# Altium schematic sheet MCU.SchDoc
size A3; Revision: C.2(PCB.SCH)
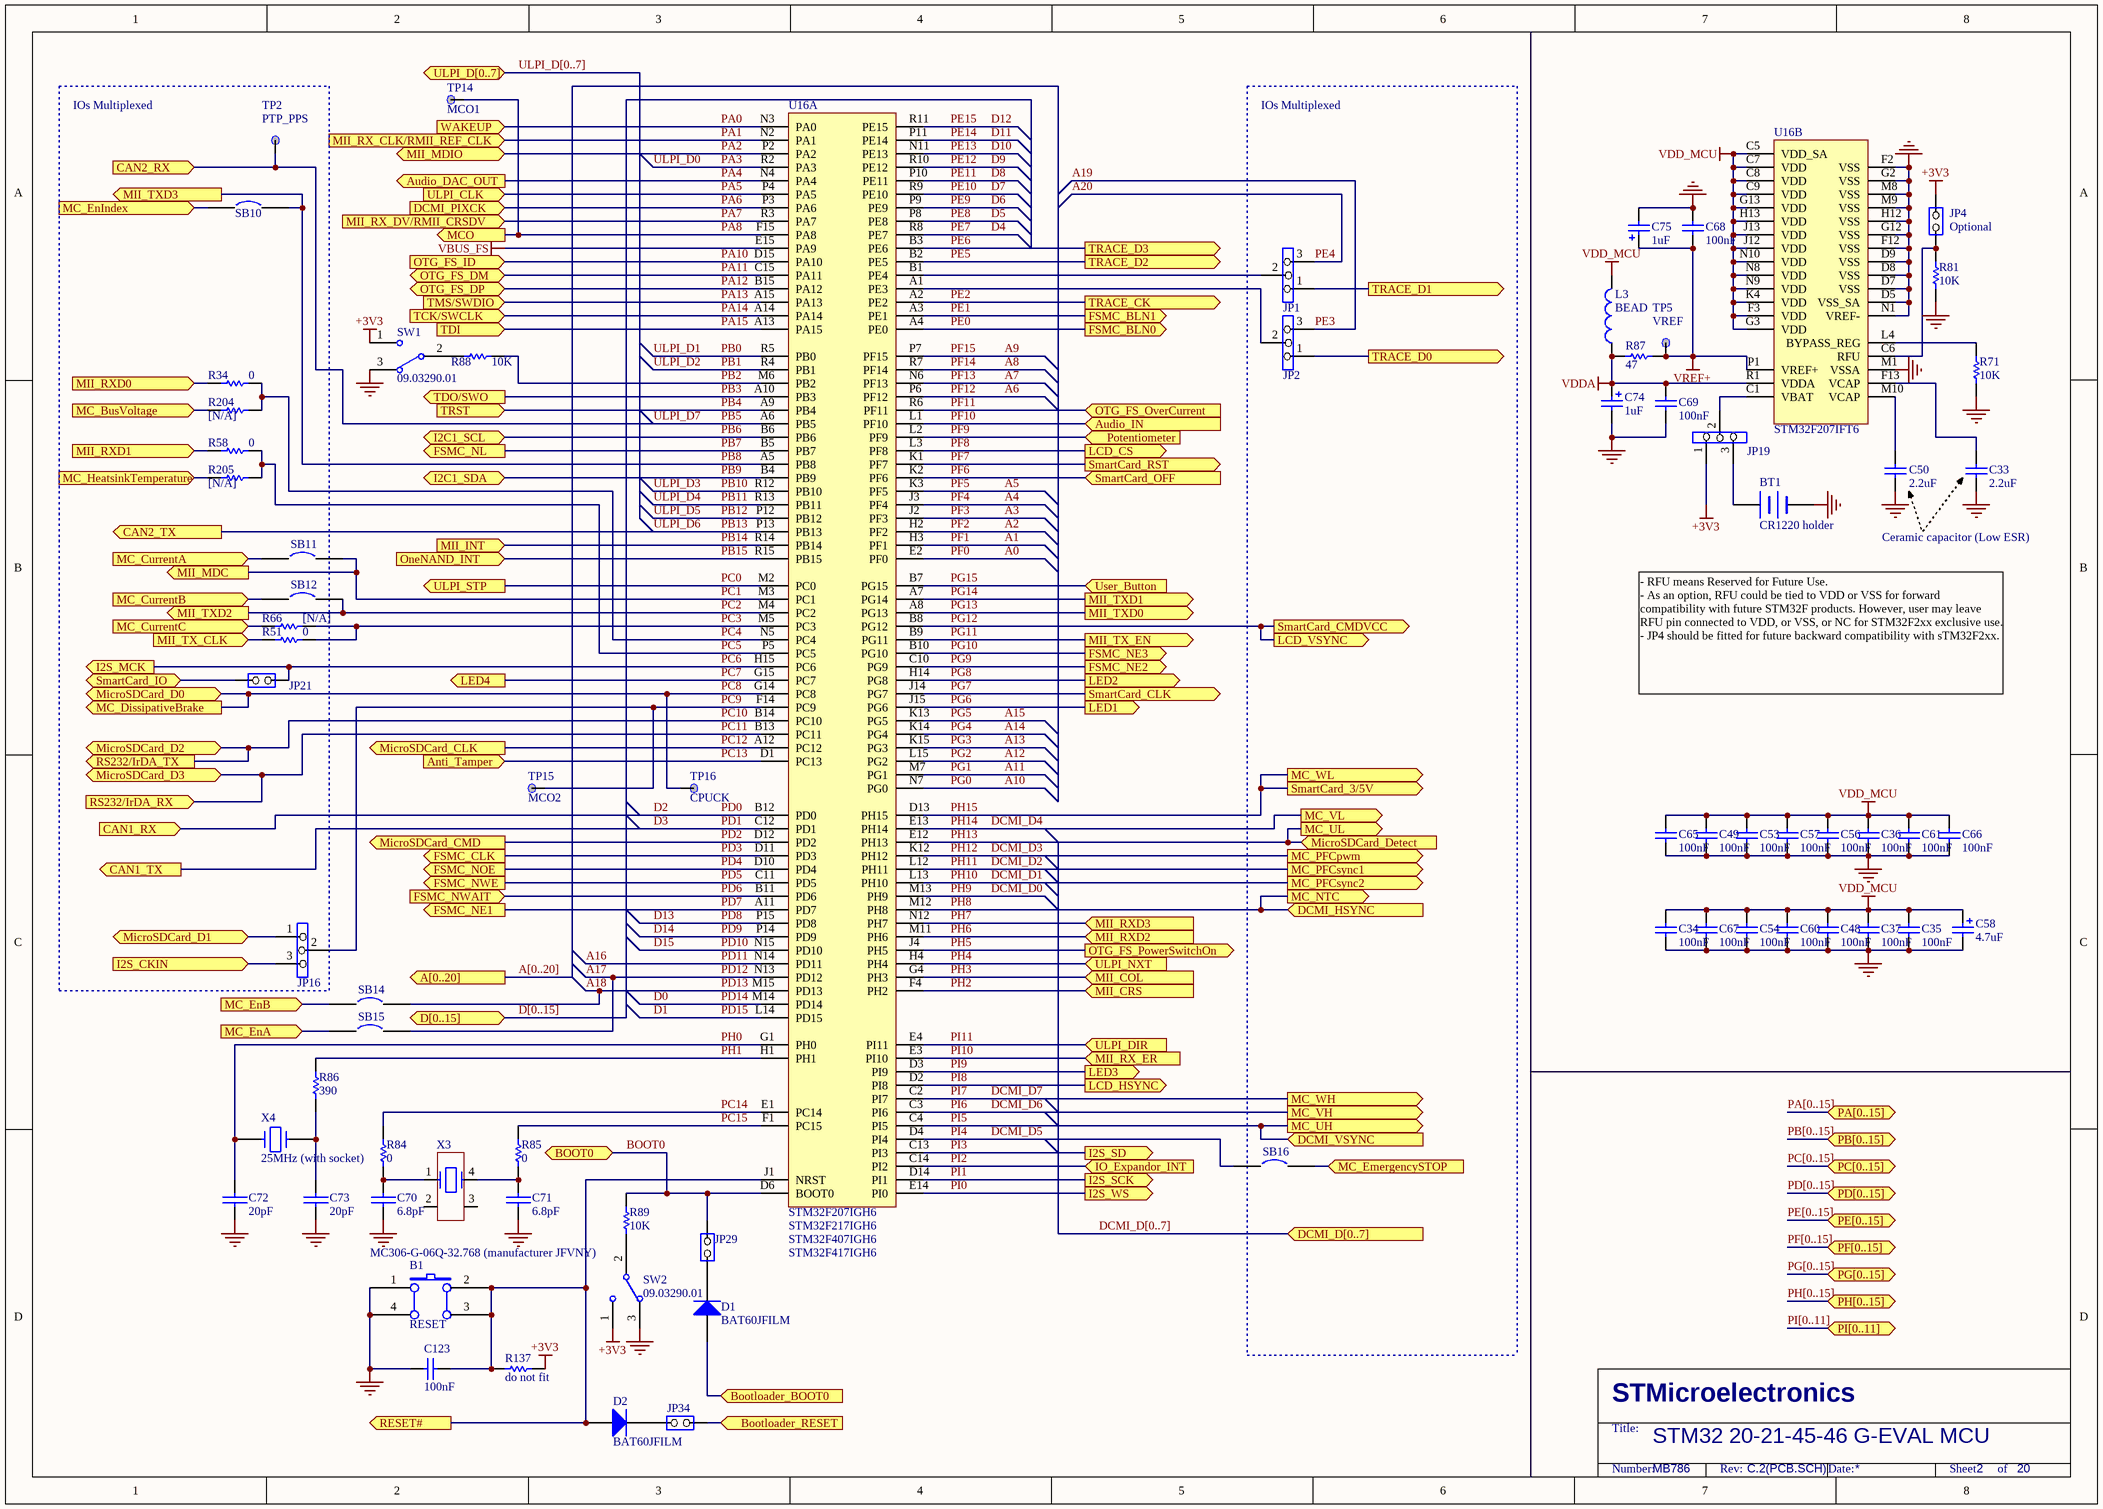
[diagram p0: MCU.SchDoc]

## Parts
B1  RESET  [PB10]
BT1  CR1220 holder  [LI1220_1]
C33  2.2uF  [1206C]
C34  100nF  [0402C]
C35  100nF  [0402C]
C36  100nF  [0402C]
C37  100nF  [0402C]
C48  100nF  [0402C]
C49  100nF  [0402C]
C50  2.2uF  [1206C]
C53  100nF  [0402C]
C54  100nF  [0402C]
C56  100nF  [0402C]
C57  100nF  [0402C]
C58  4.7uF  [TAN-A]
C60  100nF  [0402C]
C61  100nF  [0402C]
C65  100nF  [0402C]
C66  100nF  [0402C]
C67  100nF  [0402C]
C68  100nF  [0402C]
C69  100nF  [0402C]
C70  6.8pF  [0603C]
C71  6.8pF  [0603C]
C72  20pF  [0603C]
C73  20pF  [0603C]
C74  1uF  [TAN-A]
C75  1uF  [TAN-A]
C123  100nF  [0402C]
D1  BAT60JFILM  [SOD-323]
D2  BAT60JFILM  [SOD-323]
JP1  (no value)  [SIP3]
JP2  (no value)  [SIP3]
JP4  (no value)  [SIP2]
JP16  (no value)  [SIP3]
JP19  (no value)  [SIP3]
JP21  (no value)  [SIP2]
JP29  (no value)  [SIP2]
JP34  (no value)  [SIP2]
L3  BEAD  [0603L]
R34  0  [0603R]
R51  0  [0603R]
R58  0  [0603R]
R66  [N/A]  [0603R]
R71  10K  [0402R]
R81  10K  [0402R]
R84  0  [0603R]
R85  0  [0603R]
R86  390  [0603R]
R87  47  [0603R]
R88  10K  [0402R]
R89  10K  [0402R]
R137  do not fit  [0603R]
R204  [N/A]  [0603R]
R205  [N/A]  [0603R]
SB10  (no value)  [JP2_SMD]
SB11  (no value)  [JP2_SMD]
SB12  (no value)  [JP2_SMD]
SB14  (no value)  [JP2_SMD]
SB15  (no value)  [JP2_SMD]
SB16  (no value)  [JP2_SMD]
SW1  09.03290.01  [SIP3]
SW2  09.03290.01  [SIP3]
TP2  PTP_PPS  [TP]
TP5  VREF  [TP]
TP14  MCO1  [TP]
TP15  MCO2  [TP]
TP16  CPUCK  [TP]
U16  STM32F207IGH6  [UFBGA176]  (parts A,B of 2)
X3  MC306-G-06Q-32.768 (manufacturer JFVNY)  [SM8]
X4  25MHz (with socket)  [XTAL_socket]

## Blocks framed on the sheet
IOs Multiplexed: JP1 JP2 SB16

## Ports
A[0..20] (out), Anti_Tamper (in), Audio_DAC_OUT (out), Audio_IN (in), BOOT0 (bidir), Bootloader_BOOT0 (in), Bootloader_RESET (in), CAN1_RX (in), CAN1_TX (out), CAN2_RX (in), CAN2_TX (out), D[0..15] (bidir), DCMI_D[0..7] (in), DCMI_HSYNC (in), DCMI_PIXCK (in), DCMI_VSYNC (in), FSMC_BLN0 (out), FSMC_BLN1 (out), FSMC_CLK (out), FSMC_NE1 (out), FSMC_NE2 (out), FSMC_NE3 (out), FSMC_NL (out), FSMC_NOE (out), FSMC_NWAIT (in), FSMC_NWE (out), I2C1_SCL (bidir), I2C1_SDA (bidir), I2S_CKIN (in), I2S_MCK (out), I2S_SCK (out), I2S_SD (out), I2S_WS (out), IO_Expandor_INT (in), LCD_CS (out), LCD_HSYNC (out), LCD_VSYNC (out), LED1 (out), LED2 (out), LED3 (out), LED4 (out), MC_BusVoltage (in), MC_CurrentA (in), MC_CurrentB (in), MC_CurrentC (in), MC_DissipativeBrake (out), MC_EmergencySTOP (in), MC_EnA (in), MC_EnB (in), MC_EnIndex (in), MC_HeatsinkTemperature (in), MC_NTC (out), MC_PFCpwm (out), MC_PFCsync1 (out), MC_PFCsync2 (out), MC_UH (out), MC_UL (out), MC_VH (out), MC_VL (out), MC_WH (out), MC_WL (out), MCO (out), MicroSDCard_CLK (out), MicroSDCard_CMD (out), MicroSDCard_D0 (bidir), MicroSDCard_D1 (bidir), MicroSDCard_D2 (bidir), MicroSDCard_D3 (bidir), MicroSDCard_Detect (in), MII_COL (in), MII_CRS (in), MII_INT (in), MII_MDC (out), MII_MDIO (bidir), MII_RX_CLK/RMII_REF_CLK (in), MII_RX_DV/RMII_CRSDV (in), MII_RX_ER (in), MII_RXD0 (in), MII_RXD1 (in), MII_RXD2 (in), MII_RXD3 (in), MII_TX_CLK (in), MII_TX_EN (out), MII_TXD0 (out), MII_TXD1 (out), MII_TXD2 (out), MII_TXD3 (out), OneNAND_INT (in), OTG_FS_DM (bidir), OTG_FS_DP (bidir), OTG_FS_ID (in), OTG_FS_OverCurrent (in), OTG_FS_PowerSwitchOn (out), PA[0..15] (bidir), PB[0..15] (bidir), PC[0..15] (bidir), PD[0..15] (bidir), PE[0..15] (bidir), PF[0..15] (bidir), PG[0..15] (bidir), PH[0..15] (bidir), PI[0..11] (bidir), Potentiometer (in), RESET# (out), RS232/IrDA_RX (in), RS232/IrDA_TX (out), SmartCard_3/5V (out), SmartCard_CLK (out), SmartCard_CMDVCC (out), SmartCard_IO (bidir), SmartCard_OFF (in), SmartCard_RST (out), TCK/SWCLK (in), TDI (in), TDO/SWO (out), TMS/SWDIO (in), TRACE_CK (out), TRACE_D0 (out), TRACE_D1 (out), TRACE_D2 (out), TRACE_D3 (out), TRST (in), ULPI_CLK (in), ULPI_D[0..7] (bidir), ULPI_DIR (in), ULPI_NXT (in), ULPI_STP (out), User_Button (in), WAKEUP (in)

## Nets
+3V3: JP4.1(COMMON) JP19.1 R137.2 SW1.1 SW2.1
GND: B1.1(A0) B1.4(A1) BT1.2(-) C33.2 C34.2 C35.2 C36.2 C37.2 C48.2 C49.2 C50.2 C53.2 C54.2 C56.2 C57.2 C58.2 C60.2 C61.2 C65.2 C66.2 C67.2 C68.2 C69.2 C70.2 C71.2 C72.2 C73.2 C74.2 C75.2 C123.1 R71.2 R81.2 SW1.3 SW2.3 U16.D5(VSS_SA) U16.D7(VSS) U16.D8(VSS) U16.D9(VSS) U16.F2(VSS) U16.F12(VSS) U16.G2(VSS) U16.G12(VSS) U16.H12(VSS) U16.M1(VSSA) U16.M8(VSS) U16.M9(VSS) U16.N1(VREF-)
VBUS_FS: U16.E15(PA9)
VDD_MCU: C34.1 C35.1 C36.1 C37.1 C48.1 C49.1 C53.1 C54.1 C56.1 C57.1 C58.1 C60.1 C61.1 C65.1 C66.1 C67.1 L3.2 U16.C5(VDD_SA) U16.C7(VDD) U16.C8(VDD) U16.C9(VDD) U16.F3(VDD) U16.G3(VDD) U16.G13(VDD) U16.H13(VDD) U16.J12(VDD) U16.J13(VDD) U16.K4(VDD) U16.N8(VDD) U16.N9(VDD) U16.N10(VDD)
VDDA: C69.1 C74.1 L3.1 R87.2 U16.R1(VDDA)
VREF+: C68.1 C75.1 R87.1 TP5.1 U16.P1(VREF+)
A0: U16.E2(PF0)  [also labelled PF0]
A1: U16.H3(PF1)  [also labelled PF1]
A2: U16.H2(PF2)  [also labelled PF2]
A3: U16.J2(PF3)  [also labelled PF3]
A4: U16.J3(PF4)  [also labelled PF4]
A5: U16.K3(PF5)  [also labelled PF5]
A6: U16.P6(PF12)  [also labelled PF12]
A7: U16.N6(PF13)  [also labelled PF13]
A8: U16.R7(PF14)  [also labelled PF14]
A9: U16.P7(PF15)  [also labelled PF15]
A10: U16.N7(PG0)  [also labelled PG0]
A11: U16.M7(PG1)  [also labelled PG1]
A12: U16.L15(PG2)  [also labelled PG2]
A13: U16.K15(PG3)  [also labelled PG3]
A14: U16.K14(PG4)  [also labelled PG4]
A15: U16.K13(PG5)  [also labelled PG5]
A16: U16.N14(PD11)  [also labelled PD11]
A17: SB15.2 U16.N13(PD12)  [also labelled PD12]
A18: SB14.2 U16.M15(PD13)  [also labelled PD13]
A19: JP2.3  [also labelled PE3]
A20: JP1.3  [also labelled PE4]
BOOT0: JP29.1(COMMON) R89.1 U16.D6(BOOT0) ; port BOOT0
Bootloader_BOOT0: D1.1(A) ; port Bootloader_BOOT0
Bootloader_RESET: JP34.2(NO) ; port Bootloader_RESET
D0: U16.M14(PD14)  [also labelled PD14]
D1: U16.L14(PD15)  [also labelled PD15]
D2: U16.B12(PD0) ; port CAN1_RX  [also labelled PD0]
D3: U16.C12(PD1) ; port CAN1_TX  [also labelled PD1]
D4: U16.R8(PE7)  [also labelled PE7]
D5: U16.P8(PE8)  [also labelled PE8]
D6: U16.P9(PE9)  [also labelled PE9]
D7: U16.R9(PE10)  [also labelled PE10]
D8: U16.P10(PE11)  [also labelled PE11]
D9: U16.R10(PE12)  [also labelled PE12]
D10: U16.N11(PE13)  [also labelled PE13]
D11: U16.P11(PE14)  [also labelled PE14]
D12: U16.R11(PE15)  [also labelled PE15]
D13: U16.P15(PD8)  [also labelled PD8]
D14: U16.P14(PD9)  [also labelled PD9]
D15: U16.N15(PD10)  [also labelled PD10]
DCMI_D0: U16.M13(PH9)  [also labelled PH9]
DCMI_D1: U16.L13(PH10) ; port MC_PFCsync2  [also labelled PH10]
DCMI_D2: U16.L12(PH11) ; port MC_PFCsync1  [also labelled PH11]
DCMI_D3: U16.K12(PH12) ; port MC_PFCpwm  [also labelled PH12]
DCMI_D4: U16.E13(PH14) ; port MC_VL  [also labelled PH14]
DCMI_D5: SB16.1 U16.D4(PI4)  [also labelled PI4]
DCMI_D6: U16.C3(PI6) ; port MC_VH  [also labelled PI6]
DCMI_D7: U16.C2(PI7) ; port MC_WH  [also labelled PI7]
I2S_CKIN: JP16.3 ; port I2S_CKIN
MC_BusVoltage: R204.1 ; port MC_BusVoltage
MC_CurrentA: SB11.1 ; port MC_CurrentA
MC_CurrentB: SB12.1 ; port MC_CurrentB
MC_CurrentC: R66.1 ; port MC_CurrentC
MC_EmergencySTOP: SB16.2 ; port MC_EmergencySTOP
MC_EnA: SB15.1 ; port MC_EnA
MC_EnB: SB14.1 ; port MC_EnB
MC_EnIndex: SB10.1 ; port MC_EnIndex
MC_HeatsinkTemperature: R205.1 ; port MC_HeatsinkTemperature
MicroSDCard_D1: JP16.1 ; port MicroSDCard_D1
MII_RXD0: R34.1 ; port MII_RXD0
MII_RXD1: R58.1 ; port MII_RXD1
MII_TX_CLK: R51.1 ; port MII_TX_CLK
PA0: U16.N3(PA0) ; port WAKEUP
PA1: U16.N2(PA1) ; port MII_RX_CLK/RMII_REF_CLK
PA2: U16.P2(PA2) ; port MII_MDIO
PA3: U16.R2(PA3)  [also labelled ULPI_D0]
PA4: U16.N4(PA4) ; port Audio_DAC_OUT
PA5: U16.P4(PA5) ; port ULPI_CLK
PA6: U16.P3(PA6) ; port DCMI_PIXCK
PA7: U16.R3(PA7) ; port MII_RX_DV/RMII_CRSDV
PA8: TP14.1 U16.F15(PA8) ; port MCO
PA10: U16.D15(PA10) ; port OTG_FS_ID
PA11: U16.C15(PA11) ; port OTG_FS_DM
PA12: U16.B15(PA12) ; port OTG_FS_DP
PA13: U16.A15(PA13) ; port TMS/SWDIO
PA14: U16.A14(PA14) ; port TCK/SWCLK
PA15: U16.A13(PA15) ; port TDI
PB0: U16.R5(PB0)  [also labelled ULPI_D1]
PB1: U16.R4(PB1)  [also labelled ULPI_D2]
PB2: R88.1 U16.M6(PB2)
PB3: U16.A10(PB3) ; port TDO/SWO
PB4: U16.A9(PB4) ; port TRST
PB5: TP2.1 U16.A6(PB5) ; port CAN2_RX  [also labelled ULPI_D7]
PB6: U16.B6(PB6) ; port I2C1_SCL
PB7: U16.B5(PB7) ; port FSMC_NL
PB8: SB10.2 U16.A5(PB8) ; port MII_TXD3
PB9: U16.B4(PB9) ; port I2C1_SDA
PB10: U16.R12(PB10)  [also labelled ULPI_D3]
PB11: U16.R13(PB11)  [also labelled ULPI_D4]
PB12: U16.P12(PB12)  [also labelled ULPI_D5]
PB13: U16.P13(PB13) ; port CAN2_TX  [also labelled ULPI_D6]
PB14: U16.R14(PB14) ; port MII_INT
PB15: U16.R15(PB15) ; port OneNAND_INT
PC0: U16.M2(PC0) ; port ULPI_STP
PC1: SB11.2 U16.M3(PC1) ; port MII_MDC
PC2: SB12.2 U16.M4(PC2) ; port MII_TXD2
PC3: R51.2 R66.2 U16.M5(PC3)
PC4: R34.2 R204.2 U16.N5(PC4)
PC5: R58.2 R205.2 U16.P5(PC5)
PC6: JP21.1(COMMON) U16.H15(PC6) ; port I2S_MCK
PC7: U16.G15(PC7) ; port LED4
PC8: TP16.1 U16.G14(PC8) ; port MicroSDCard_D0, port MC_DissipativeBrake
PC9: JP16.2 TP15.1 U16.F14(PC9)
PC10: U16.B14(PC10) ; port RS232/IrDA_TX, port MicroSDCard_D2
PC11: U16.B13(PC11) ; port RS232/IrDA_RX, port MicroSDCard_D3
PC12: U16.A12(PC12) ; port MicroSDCard_CLK
PC13: U16.D1(PC13) ; port Anti_Tamper
PC14: R84.2 U16.E1(PC14)
PC15: R85.2 U16.F1(PC15)
PD2: U16.D12(PD2) ; port MicroSDCard_CMD
PD3: U16.D11(PD3) ; port FSMC_CLK
PD4: U16.D10(PD4) ; port FSMC_NOE
PD5: U16.C11(PD5) ; port FSMC_NWE
PD6: U16.B11(PD6) ; port FSMC_NWAIT
PD7: U16.A11(PD7) ; port FSMC_NE1
PE0: U16.A4(PE0) ; port FSMC_BLN0
PE1: U16.A3(PE1) ; port FSMC_BLN1
PE2: U16.A2(PE2) ; port TRACE_CK
PE5: U16.B2(PE5) ; port TRACE_D2
PE6: U16.B3(PE6) ; port TRACE_D3
PF6: U16.K2(PF6) ; port SmartCard_OFF
PF7: U16.K1(PF7) ; port SmartCard_RST
PF8: U16.L3(PF8) ; port LCD_CS
PF9: U16.L2(PF9) ; port Potentiometer
PF10: U16.L1(PF10) ; port Audio_IN
PF11: U16.R6(PF11) ; port OTG_FS_OverCurrent
PG6: U16.J15(PG6) ; port LED1
PG7: U16.J14(PG7) ; port SmartCard_CLK
PG8: U16.H14(PG8) ; port LED2
PG9: U16.C10(PG9) ; port FSMC_NE2
PG10: U16.B10(PG10) ; port FSMC_NE3
PG11: U16.B9(PG11) ; port MII_TX_EN
PG12: U16.B8(PG12) ; port SmartCard_CMDVCC, port LCD_VSYNC
PG13: U16.A8(PG13) ; port MII_TXD0
PG14: U16.A7(PG14) ; port MII_TXD1
PG15: U16.B7(PG15) ; port User_Button
PH0: C72.1 U16.G1(PH0) X4.2
PH1: R86.1 U16.H1(PH1)
PH2: U16.F4(PH2) ; port MII_CRS
PH3: U16.G4(PH3) ; port MII_COL
PH4: U16.H4(PH4) ; port ULPI_NXT
PH5: U16.J4(PH5) ; port OTG_FS_PowerSwitchOn
PH6: U16.M11(PH6) ; port MII_RXD2
PH7: U16.N12(PH7) ; port MII_RXD3
PH8: U16.M12(PH8) ; port DCMI_HSYNC, port MC_NTC
PH13: U16.E12(PH13) ; port MicroSDCard_Detect, port MC_UL
PH15: U16.D13(PH15) ; port MC_WL, port SmartCard_3/5V
PI0: U16.E14(PI0) ; port I2S_WS
PI1: U16.D14(PI1) ; port I2S_SCK
PI2: U16.C14(PI2) ; port IO_Expandor_INT
PI3: U16.C13(PI3) ; port I2S_SD
PI5: U16.C4(PI5) ; port DCMI_VSYNC, port MC_UH
PI8: U16.D2(PI8) ; port LCD_HSYNC
PI9: U16.D3(PI9) ; port LED3
PI10: U16.E3(PI10) ; port MII_RX_ER
PI11: U16.E4(PI11) ; port ULPI_DIR
RESET#: B1.2(B0) B1.3(B1) C123.2 D2.1(A) R137.1 U16.J1(NRST) ; port RESET#
SmartCard_IO: JP21.2(NO) ; port SmartCard_IO
TRACE_D0: JP2.1 ; port TRACE_D0
TRACE_D1: JP1.1 ; port TRACE_D1
NetBT1_1: BT1.1(+) JP19.3
NetC33_1: C33.1 U16.F13(VCAP)
NetC50_1: C50.1 U16.M10(VCAP)
NetC70_1: C70.1 R84.1 X3.1
NetC71_1: C71.1 R85.1 X3.4
NetC73_1: C73.1 R86.2 X4.1
NetD1_2: D1.2(K) JP29.2(NO)
NetD2_2: D2.2(K) JP34.1(COMMON)
NetJP1_2: JP1.2 U16.B1(PE4)
NetJP2_2: JP2.2 U16.A1(PE3)
NetJP4_2: JP4.2(NO) R81.1 U16.C6(RFU)
NetJP19_2: JP19.2 U16.C1(VBAT)
NetR71_1: R71.1 U16.L4(BYPASS_REG)
NetR88_2: R88.2 SW1.2
NetR89_2: R89.2 SW2.2

Not connected (* = marked no-connect by the designer): X3 2 3

## Buses and harness runs
bus A[0..20] = port A[0..20]
bus D[0..15] = port D[0..15]
bus DCMI_D[0..7] = port DCMI_D[0..7]
bus PA[0..15] = port PA[0..15]
bus PB[0..15] = port PB[0..15]
bus PC[0..15] = port PC[0..15]
bus PD[0..15] = port PD[0..15]
bus PE[0..15] = port PE[0..15]
bus PF[0..15] = port PF[0..15]
bus PG[0..15] = port PG[0..15]
bus PH[0..15] = port PH[0..15]
bus PI[0..11] = port PI[0..11]
bus ULPI_D[0..7] = port ULPI_D[0..7]

## Notes on the sheet
- IOs Multiplexed
- (near JP4) Optional
- Ceramic capacitor (Low ESR)
- - RFU means Reserved for Future Use.
  - As an option, RFU could be tied to VDD or VSS for forward compatibility with future STM32F products. However, user may leave RFU pin connected to VDD, or VSS, or NC for STM32F2xx exclusive use.
  - JP4 should be fitted for future backward compatibility with sTM32F2xx.
- (near U16) STM32F217IGH6
- (near U16) STM32F407IGH6
- STM32F417IGH6
- STM32 20-21-45-46 G-EVAL MCU
- MB786
- 2
- 20
- STMicroelectronics
- Title:
- Number:
- Rev:
- Date:
- Sheet       of

## Library data of the parts
B1 = SW PUSHBUTTON: SE PUSHBUTTON
BT1 = BATTERY
C33-C37 C48-C50 C53 C54 C56 C57 C60 C61 C65-C69 = Cap: Capacitor; Value: 10nF; Published: 8-Jun-2000; Revision: July-2002: Re-released for DXP Platform.; Publisher: Altium Limited
C58 = Cap Pol1: Polarized Capacitor (Radial); Value: 47uF; Published: 8-Jun-2000; Revision: July-2002: Re-released for DXP Platform.; Publisher: Altium Limited
C70-C73 = CAP: Capacitor
C74 C75 = Cap Pol1: Polarized Capacitor (Radial); Value: 10uF; Published: 8-Jun-2000; Revision: July-2002: Re-released for DXP Platform.; Publisher: Altium Limited
C123 = CAP: Capacitor; Value: 100pF; Published: 8-Jun-2000; Revision: July-2002: Re-released for DXP Platform.; Publisher: Altium Limited
D1 D2 = Diode: Default Diode; Code - JEDEC: DO-214-AB; Published: 8-Jun-2000; Revision: July-2002: Re-released for DXP Platform.; Publisher: Altium Limited
JP1 JP2 JP16 JP19 = Jumper3
JP4 JP21 JP29 JP34 = JP2
L3 = Inductor: Value: 100uH; Published: 8-Jun-2000; Revision: July-2002: Re-released for DXP Platform.; Publisher: Altium Limited
R34 R51 R58 R66 R88 R89 R137 R204 R205 = res1: Resistor; Value: 1K; Published: 8-Jun-2000; Revision: July-2002: Re-released for DXP Platform.; Publisher: Altium Limited
R71 R81 R84-R87 = Res1: Resistor; Value: 1K; Published: 8-Jun-2000; Revision: July-2002: Re-released for DXP Platform.; Publisher: Altium Limited
SB10-SB12 SB14-SB16 = Circuit Breaker: Published: 24-Mar-1999; Revision: July-2002: Re-released for DXP Platform.; Publisher: Altium Limited
SW1 SW2 = SW-SPDT: SPDT Subminiature Toggle Switch, Right Angle Mounting, Vertical Actuation; Revision 1: Jul-2002: Re-released for DXP Platform.; Revision 2: 17-Dec-2003: Schematic revised, PCB Footprint replaced.; Published: 24-Mar-1999; Datasheet: Latest Revision: 05-Dec-2000; Publisher: Altium Limited
TP2 TP5 TP14-TP16 = TP
U16 = MANGUSTA_BGA176
X3 = MC306
X4 = CRYSTAL